# EAGLE design m80-v0.50 (EAGLE 9.6.2)
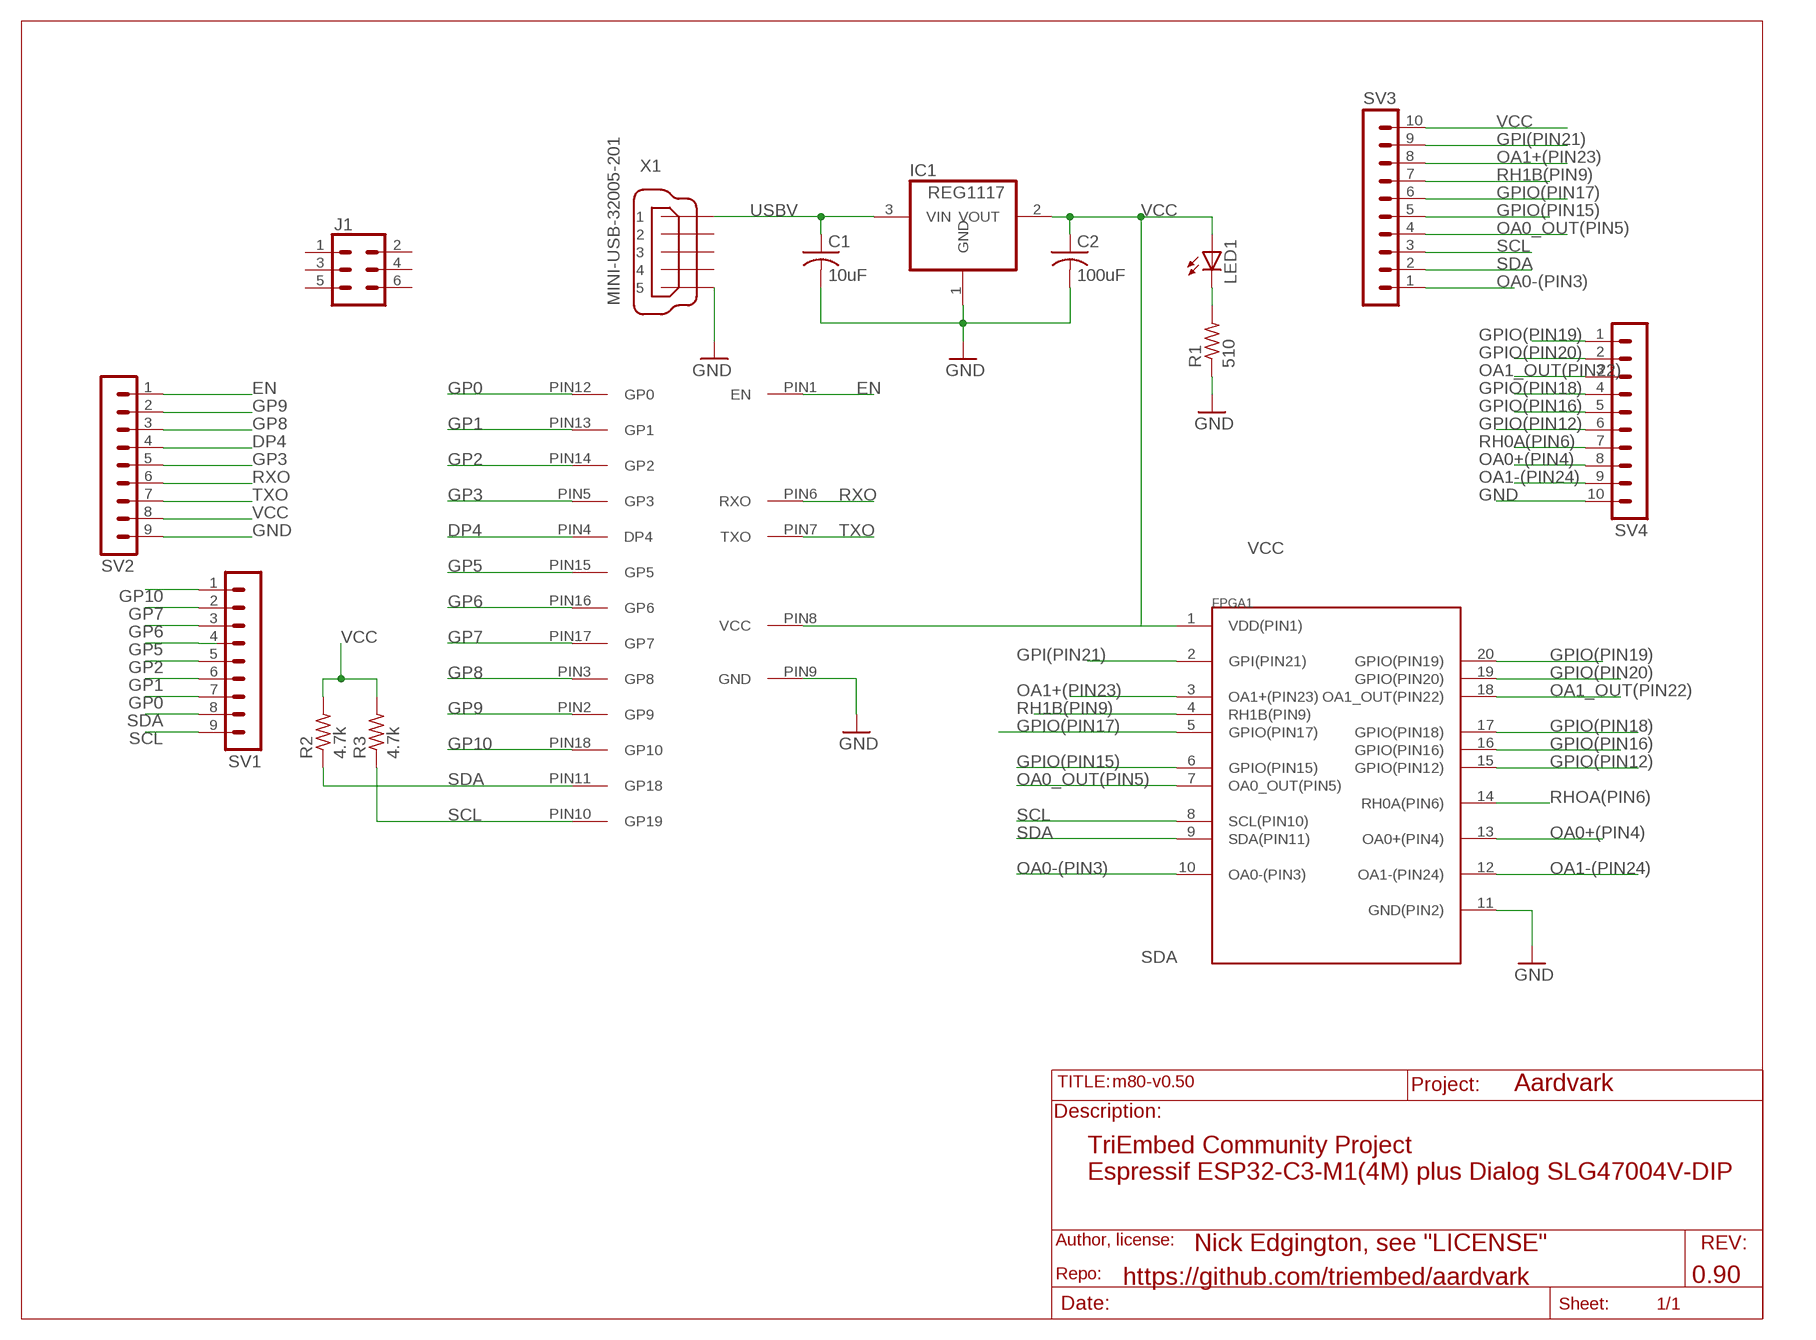
[diagram p0: schematic, sheet 1]

## Parts
C1  10uF  C-USC0805  [C0805]
C2  100uF  C-USC1206  [C1206]
FPGA1  SLG7004V_DIP  [SLG47004V-DIP]
IC1  REG1117  [SOT223]
J1  CONN_03X2NO_SILK  [2X3-NS]
LED1  LEDCHIP-LED0805  [CHIP-LED0805]
R1  510  R-US_R0805  [R0805]
R2  4.7k  R-US_R0805  [R0805]
R3  4.7k  R-US_R0805  [R0805]
SV1  MA09-1  [MA09-1]
SV2  MA09-1  [MA09-1]
SV3  MA10-1  [MA10-1]
SV4  MA10-1  [MA10-1]
U$2  UNTITLED_ESP32C3  [UNTITLED_ESP32-C3-01M]
X1  MINI-USB-32005-201  [32005-201]

## Nets
DP4: SV2.4 U$2.PIN4(DP4)
EN: SV2.1 U$2.PIN1(EN)
GND [power]: C1.2 C2.2 FPGA1.11(GND(PIN2)) IC1.1(GND) R1.1 SV2.9 SV4.10 U$2.PIN9(GND) X1.5
GP0: SV1.7 U$2.PIN12(GP0)
GP1: SV1.6 U$2.PIN13(GP1)
GP2: SV1.5 U$2.PIN14(GP2)
GP3: SV2.5 U$2.PIN5(GP3)
GP5: SV1.4 U$2.PIN15(GP5)
GP6: SV1.3 U$2.PIN16(GP6)
GP7: SV1.2 U$2.PIN17(GP7)
GP8: SV2.3 U$2.PIN3(GP8)
GP9: SV2.2 U$2.PIN2(GP9)
GP10: SV1.1 U$2.PIN18(GP10)
GPI(PIN21): FPGA1.2(GPI(PIN21)) SV3.9
GPIO(PIN12): FPGA1.15(GPIO(PIN12)) SV4.6
GPIO(PIN15): FPGA1.6(GPIO(PIN15)) SV3.5
GPIO(PIN16): FPGA1.16(GPIO(PIN16)) SV4.5
GPIO(PIN17): FPGA1.5(GPIO(PIN17)) SV3.6
GPIO(PIN18): FPGA1.17(GPIO(PIN18)) SV4.4
GPIO(PIN19): FPGA1.20(GPIO(PIN19)) SV4.1
GPIO(PIN20): FPGA1.19(GPIO(PIN20)) SV4.2
N$3: LED1.C R1.2
OA0+(PIN4): FPGA1.13(OA0+(PIN4)) SV4.8
OA0-(PIN3): FPGA1.10(OA0-(PIN3)) SV3.1
OA0_OUT(PIN5): FPGA1.7(OA0_OUT(PIN5)) SV3.4
OA1+(PIN23): FPGA1.3(OA1+(PIN23)) SV3.8
OA1-(PIN24): FPGA1.12(OA1-(PIN24)) SV4.9
OA1_OUT(PIN22): FPGA1.18(OA1_OUT(PIN22)) SV4.3
RH0A(PIN6): SV4.7
RH1B(PIN9): FPGA1.4(RH1B(PIN9)) SV3.7
RHOA(PIN6): FPGA1.14(RH0A(PIN6))
RXO: SV2.6 U$2.PIN6(RXO)
SCL: FPGA1.8(SCL(PIN10)) R3.1 SV1.9 SV3.3 U$2.PIN10(GP19)
SDA: FPGA1.9(SDA(PIN11)) R2.1 SV1.8 SV3.2 U$2.PIN11(GP18)
TXO: SV2.7 U$2.PIN7(TXO)
USBV [power]: C1.1 IC1.3(VIN) X1.1
VCC [power]: C2.1 FPGA1.1(VDD(PIN1)) IC1.2(VOUT) LED1.A R2.2 R3.2 SV2.8 SV3.10 U$2.PIN8(VCC)
Unconnected: J1.1 J1.2 J1.3 J1.4 J1.5 J1.6 X1.2 X1.3 X1.4

## Notes on the sheet
- Aardvark
- TriEmbed Community Project
  Espressif ESP32-C3-M1(4M) plus Dialog SLG47004V-DIP
- Nick Edgington, see "LICENSE"
- https://github.com/triembed/aardvark | 0.90

## Library data of the parts
C1 C2 = rcl:C-US: CAPACITOR, American symbol; SPICEPREFIX: C
FPGA1 = 22020117-1206PM-SLG47004V-DIP:SLG7004V_DIP
IC1 = burr-brown:REG1117: 800mA and 1A Low Dropout (LDO) Positive Regulator 1.8V, 2.5V, 2.85V, 3.3V, 5V, and Adj; MPN: REG1117; OC_FARNELL: 1097566; OC_NEWARK: 14P6981
J1 = SparkFun-Connectors:CONN_03X2: Multi connection point. Often used as Generic Header-pin footprint for 0.1 inch spaced/style header connections You can populate with any combo of single row headers, but if you'd like an exact match, check these: Header - 2x3 (Male, 0.1") <https://www.sparkfun.com/products/12807> (PRT-12807) Header - 2x3 (Female, 0.1") <https://www.sparkfun.com/products/13010> (PRT-13010) 2x3 Pin Shrouded Header <https://www.sparkfun.com/products/10877> (PRT-10877) On any of the 0.1 inch spaced packages, you can populate with these: Break Away Headers - Straight <https://www.sparkfun.com/products/116> (PRT-00116) Break Away Male Headers - Right Angle <https://www.sparkfun.com/products/553> (PRT-00553) Female Headers <https://www.sparkfun.com/products/115> (PRT-00115) Break Away Headers - Machine Pin <https://www.sparkfun.com/products/117> (PRT-00117) Break Away Female Headers - Swiss Machine Pin <https://www.sparkfun.com/products/743> (PRT-00743) Special note: the shrouded connector mates well with our 3x2 ribbon cables: Ribbon Crimp Connector - 6-pin (2x3, Female) <https://www.sparkfun.com/products/10651> (PRT-10651) Ribbon Cable - 6 wire (15ft) <https://www.sparkfun.com/products/10646> (PRT-10646)
LED1 = adafruit:LED: LED OSRAM: - CHIPLED LG R971, LG N971, LY N971, LG Q971, LY Q971, LO R971, LY R971 LH N974, LH R974 LS Q976, LO Q976, LY Q976 LO Q996 - Hyper CHIPLED LW Q18S LB Q993, LB Q99A, LB R99A - SideLED LS A670, LO A670, LY A670, LG A670, LP A670 LB A673, LV A673, LT A673, LW A673 LH A674 LY A675 LS A676, LA A676, LO A676, LY A676, LW A676 LS A679, LY A679, LG A679 - Hyper Micro SIDELED® LS Y876, LA Y876, LO Y876, LY Y876 LT Y87S - SmartLED LW L88C, LW L88S LB L89C, LB L89S, LG L890 LS L89K, LO L89K, LY L89K LS L896, LA L896, LO L896, LY L896 - TOPLED LS T670, LO T670, LY T670, LG T670, LP T670 LSG T670, LSP T670, LSY T670, LOP T670, LYG T670 LG T671, LOG T671, LSG T671 LB T673, LV T673, LT T673, LW T673 LH T674 LS T676, LA T676, LO T676, LY T676, LB T676, LH T676, LSB T676, LW T676 LB T67C, LV T67C, LT T67C, LS T67K, LO T67K, LY T67K, LW E67C LS E67B, LA E67B, LO E67B, LY E67B, LB E67C, LV E67C, LT E67C LW T67C LS T679, LY T679, LG T679 LS T770, LO T770, LY T770, LG T770, LP T770 LB T773, LV T773, LT T773, LW T773 LH T774 LS E675, LA E675, LY E675, LS T675 LS T776, LA T776, LO T776, LY T776, LB T776 LHGB T686 LT T68C, LB T68C - Hyper Mini TOPLED® LB M676 - Mini TOPLED Santana® LG M470 LS M47K, LO M47K, LY M47K Source: http://www.osram.convergy.de/
R1-R3 = rcl:R-US_: RESISTOR, American symbol; SPICEPREFIX: R
SV1 SV2 = con-lstb:MA09-1: PIN HEADER; OC_FARNELL: unknown; OC_NEWARK: unknown
SV3 SV4 = con-lstb:MA10-1: PIN HEADER; OC_FARNELL: unknown; OC_NEWARK: unknown
U$2 = aardvark-v0.01:UNTITLED_ESP32C3
X1 = con-cypressindustries:MINI-USB-: MINI USB-B Conector Source: www.cypressindustries.com; OC_FARNELL: unknown; OC_NEWARK: unknown

## Net classes
1 power: width 0.381 mm

## Board
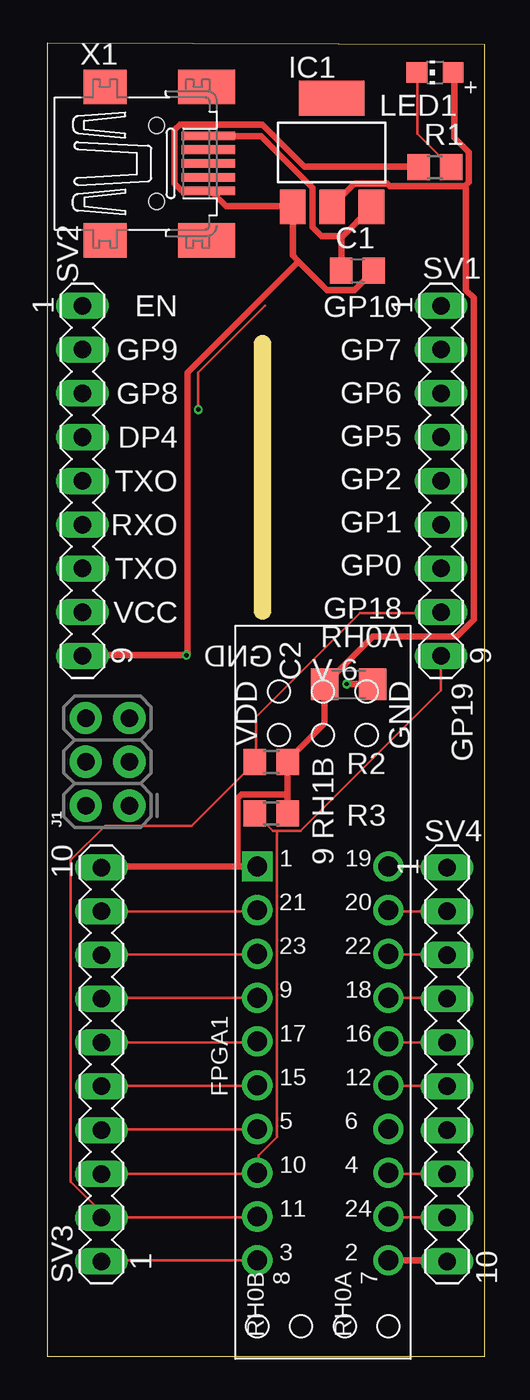
[diagram p1: board, top side]
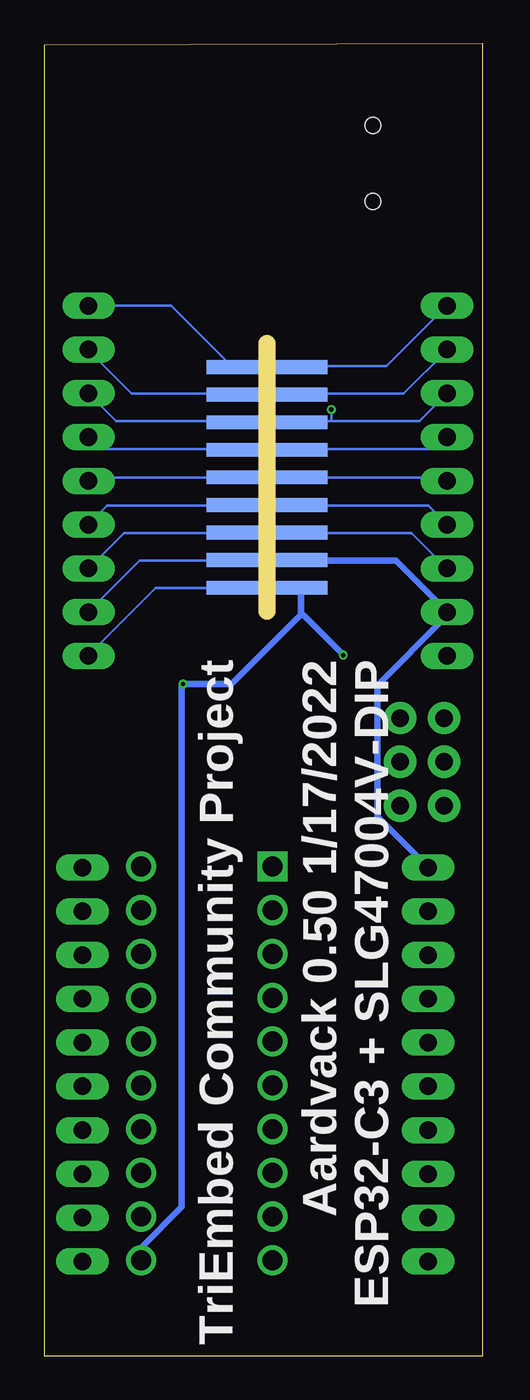
[diagram p2: board, bottom side, seen from below]

Size 25.4 x 76.2 mm. Coordinates in mm from the lower left corner, seen from the top.
Outline: 0,0 25.4,0 25.4,76.1 0,76.2 0,0
Copper layers (1*16): Top 0.035559375mm / dielectric 1.6mm / Bottom 0.035559375mm
Design rules "oshpark-2layer": minimum track width 6mil, minimum drill 10mil, track to track 6mil, track to pad 6mil, pad to pad 6mil, via to via 6mil, smd to smd 6mil, copper to edge 15mil, drill to drill 6mil, minimum pad ring 5mil, minimum via ring 5mil, stop-mask expansion 2.5mil, vias tented up to drill 0mil, thermal gap 10mil

### Footprints (pad centres in the part's own frame; a part is rotated, then mirrored left to right if it is on the bottom)
C0805 = smd 1.3 x 1.5: 1 -0.95,0; 2 0.95,0
C1206 = smd 1.6 x 1.8: 1 -1.4,0; 2 1.4,0
SLG47004V-DIP = drill 1.15 pad 1.75 square: 1 -11.43,-3.81 | drill 1.15 pad 1.75: 2 -8.89,-3.81; 3 -6.35,-3.81; 4 -3.81,-3.81; 5 -1.276,-3.81; 6 1.27,-3.81; 7 3.81,-3.81; 8 6.35,-3.81; 9 8.89,-3.81; 10 11.43,-3.81; 11 11.43,3.81; 12 8.89,3.81; 13 6.35,3.81; 14 3.81,3.81; 15 1.27,3.81; 16 -1.27,3.81; 17 -3.81,3.81; 18 -6.35,3.81; 19 -8.89,3.81; 20 -11.43,3.81
SOT223 = smd 1.499 x 2.007: 1 -2.261,-3.15; 2 0.025,-3.15; 3 2.311,-3.15 | smd 3.81 x 2.007: 4 0,3.15
2X3-NS = drill 1.016 pad 1.88: 1 -2.54,-1.27; 2 -2.54,1.27; 3 0,-1.27; 4 0,1.27; 5 2.54,-1.27; 6 2.54,1.27
CHIP-LED0805 = smd 1.2 x 1.2: A 0,-1.05; C 0,1.05
R0805 = smd 1.3 x 1.5: 1 -0.95,0; 2 0.95,0
MA09-1 = drill 1.016 long: 1 -10.16,0; 2 -7.62,0; 3 -5.08,0; 4 -2.54,0; 5 0,0; 6 2.54,0; 7 5.08,0; 8 7.62,0; 9 10.16,0
MA10-1 = drill 1.016 long: 1 -11.43,0; 2 -8.89,0; 3 -6.35,0; 4 -3.81,0; 5 -1.27,0; 6 1.27,0; 7 3.81,0; 8 6.35,0; 9 8.89,0; 10 11.43,0
UNTITLED_ESP32-C3-01M = smd 0.8 x 3 bottom: PIN1 -6.4,-2; PIN2 -4.8,-2; PIN3 -3.2,-2; PIN4 -1.6,-2; PIN5 0,-2; PIN6 1.6,-2; PIN7 3.2,-2; PIN8 4.8,-2; PIN9 6.4,-2; PIN10 6.4,2; PIN11 4.8,2; PIN12 3.2,2; PIN13 1.6,2; PIN14 0,2; PIN15 -1.6,2; PIN16 -3.2,2; PIN17 -4.8,2; PIN18 -6.4,2 | hole 0.8: -7.75,0; 7.75,0
32005-201 = smd 3.1 x 0.5: 1 3,1.6; 2 3,0.8; 3 3,0; 4 3,-0.8; 5 3,-1.6 | smd 2.5 x 2: M1 -3,-4.45; M2 -3,4.45 | smd 3.3 x 2: M3 2.9,4.45; M4 2.9,-4.45 | hole 0.9: 0,2.2; 0,-2.2

### Placement (x,y rotation side)
C1  18,63 0 top
C2  17.5,39 0 top
FPGA1  16,17 270 top
IC1  16.51,69.85 0 top
J1  3.5,34.5 90 top
LED1  22.5,74.5 90 top
R1  22.5,69 0 top
R2  13,34.5 0 top
R3  13,31.5 0 top
SV1  22.86,50.8 270 top
SV2  2.04,50.8 270 top
SV3  3.14,16.94 90 top
SV4  23.21,16.94 270 top
U$2  12.5,51 270 top
X1  6.35,69.22 0 top

### Tracks (layer width: path | path; a pad name or v marks a point on that pad's centre or on a via)
DP4
  Bottom 0.152: U$2.PIN4 10.44,52.65 2.74,52.65 2.06,53.34 SV2.4
EN
  Bottom 0.152: U$2.PIN1 10.44,57.45 5.56,57.45 2.06,60.96 SV2.1
GND  (via drill 0.25)
  Top 0.381: 14.59,63.51 14.25,63.86 IC1.1 14.1,66.75 10.36,66.75 9.53,67.59 X1.5 9.3,67.67 7.77,67.67 7.39,68.05 7.39,71.17 7.7,71.48 12.5,71.48 14.94,69.04 21.49,69.04 R1.1 | 14.59,63.51 16.23,61.87 17.83,61.87 18.9,62.94 C1.2 | SV4.10 23.16,5.56 FPGA1.11 | v17.37,39.01 18.9,39.01 C2.2 | SV2.9 2.06,40.69 v8.08,40.69 8.15,40.84 8.15,57.07 14.59,63.51
  Bottom 0.381: 10.52,43.05 14.55,39.01 v17.37,39.01 17.45,38.86 17.45,8.69 19.74,6.4 19.74,5.64 FPGA1.11 | 10.52,43.05 10.52,44.58 U$2.PIN9 | v8.08,40.69 10.36,42.98 10.52,43.05
GP0
  Bottom 0.152: SV1.7 20.8,47.78 14.55,47.78 U$2.PIN12
GP1
  Bottom 0.152: U$2.PIN13 14.55,49.38 21.79,49.38 22.86,48.31 SV1.6
GP2
  Bottom 0.152: U$2.PIN14 14.55,50.98 22.71,50.98 22.86,50.83 SV1.5
GP3
  Bottom 0.152: U$2.PIN5 10.44,50.98 2.21,50.98 2.06,50.83 SV2.5
GP5
  Bottom 0.152: SV1.4 22.17,52.65 14.55,52.65 U$2.PIN15
GP6
  Bottom 0.152: U$2.PIN16 14.55,54.25 21.26,54.25 22.86,55.85 SV1.3
GP7
  Bottom 0.152: U$2.PIN17 14.55,55.85 20.34,55.85 22.86,58.37 SV1.2
GP8  (via drill 0.25)
  Top 0.152: 12.65,60.96 8.76,57.07 v8.76,54.94
  Bottom 0.152: 8.76,54.25 3.66,54.25 2.06,55.85 SV2.3 | 8.76,54.25 10.44,54.25 U$2.PIN3 | 8.76,54.25 v8.76,54.94
GP9
  Bottom 0.152: U$2.PIN2 10.44,55.85 4.57,55.85 2.06,58.37 SV2.2
GP10
  Bottom 0.152: U$2.PIN18 18.06,60.96 SV1.1
GPI(PIN21)
  Top 0.152: SV3.9 3.2,25.83 12.12,25.83 FPGA1.2
GPIO(PIN12)
  Top 0.152: SV4.6 23.16,15.7 19.81,15.7 FPGA1.15
GPIO(PIN15)
  Top 0.152: SV3.5 3.2,15.7 12.12,15.7 FPGA1.6
GPIO(PIN16)
  Top 0.152: SV4.5 23.16,18.21 19.81,18.21 FPGA1.16
GPIO(PIN17)
  Top 0.152: SV3.6 3.2,18.21 12.12,18.21 FPGA1.5
GPIO(PIN18)
  Top 0.152: SV4.4 23.16,20.8 FPGA1.17
GPIO(PIN19)
  Top 0.152: SV4.1 23.16,28.42 FPGA1.20
GPIO(PIN20)
  Top 0.152: SV4.2 23.16,25.83 19.81,25.83 FPGA1.19
N$3
  Top 0.152: LED1.C 21.49,74.45 21.49,70.94 23.39,69.04 R1.2
OA0+(PIN4)
  Top 0.152: SV4.8 23.16,10.59 19.81,10.59 FPGA1.13
OA0-(PIN3)
  Top 0.152: SV3.1 3.2,5.56 12.12,5.56 FPGA1.10
OA0_OUT(PIN5)
  Top 0.152: SV3.4 3.2,13.18 12.12,13.18 FPGA1.7
OA1+(PIN23)
  Top 0.152: SV3.8 3.2,23.32 12.12,23.32 FPGA1.3
OA1-(PIN24)
  Top 0.152: SV4.9 23.16,8.08 19.81,8.08 FPGA1.12
OA1_OUT(PIN22)
  Top 0.152: SV4.3 23.16,23.32 19.81,23.32 FPGA1.18
RH1B(PIN9)
  Top 0.152: SV3.7 3.2,20.8 12.12,20.8 FPGA1.4
RXO
  Bottom 0.152: U$2.PIN6 10.44,49.38 3.12,49.38 2.06,48.31 SV2.6
SCL
  Top 0.152: SV3.3 3.2,10.59 12.12,10.59 FPGA1.8 12.27,10.67 12.27,11.66 13.34,12.72 13.34,30.48 | 13.34,30.48 14.71,30.48 22.86,38.63 SV1.9 | 13.34,30.48 13.11,30.48 12.12,31.47 R3.1
  Bottom 0.152: U$2.PIN10 14.55,44.58 18.97,44.58 22.86,40.69 SV1.9
SDA
  Top 0.152: FPGA1.9 12.12,8.08 3.2,8.08 SV3.2 3.2,8.15 3.2,8.31 1.37,10.13 1.37,28.8 3.35,30.79 8.38,30.79 12.04,34.44 R2.1 12.12,34.52 12.12,37.11 18.14,43.13 22.86,43.13 SV1.8
  Bottom 0.152: U$2.PIN11 14.55,46.18 19.89,46.18 22.86,43.2 SV1.8
TXO
  Bottom 0.152: U$2.PIN7 10.44,47.78 4.12,47.78 2.06,45.72 SV2.7
USBV
  Top 0.381: 17.07,64.92 17.07,63.02 C1.1 | 17.07,64.92 18.82,66.67 IC1.3 | X1.1 9.37,70.79 12.42,70.79 15.39,67.82 15.39,65.53 15.93,65 16.92,65 17.07,64.92
VCC
  Top 0.381: 24.23,67.89 24.46,68.12 24.46,69.88 23.62,70.71 23.62,74.45 LED1.A | 24.23,67.89 19.89,67.89 19.74,68.05 17.83,68.05 16.54,66.75 IC1.2 | 13.95,32.61 13.95,34.44 R2.2 14.02,34.67 16.08,36.73 16.08,38.94 C2.1 16.23,39.09 18.9,41.76 23.77,41.76 24.77,42.75 24.77,61.42 24.31,61.87 24.31,67.74 24.23,67.89 | 13.95,32.61 13.95,31.55 R3.2 | 11.05,28.42 12.12,28.42 FPGA1.1 | 11.05,28.42 3.2,28.42 SV3.10 | 13.95,32.61 11.28,32.61 11.05,32.38 11.05,28.42
  Bottom 0.381: U$2.PIN8 10.44,46.18 5.03,46.18 2.06,43.2 SV2.8 2.13,43.05 2.13,42.9 6.1,38.94 6.1,31.32 3.2,28.42 SV3.10

### Text on the board
tNames: EN | GP10 | GP9 | GP7 | GP8 | GP6 | DP4 | GP5 | TXO | GP2 | RXO | GP1 | TXO | GP0 | VCC | GP18 | GND | GP19
bNames: TriEmbed Community Project / / Aardvack 0.50 1/17/2022 / ESP32-C3 + SLG47004V-DIP